# EAGLE schematic Granny Safe (EAGLE 8.4.0)
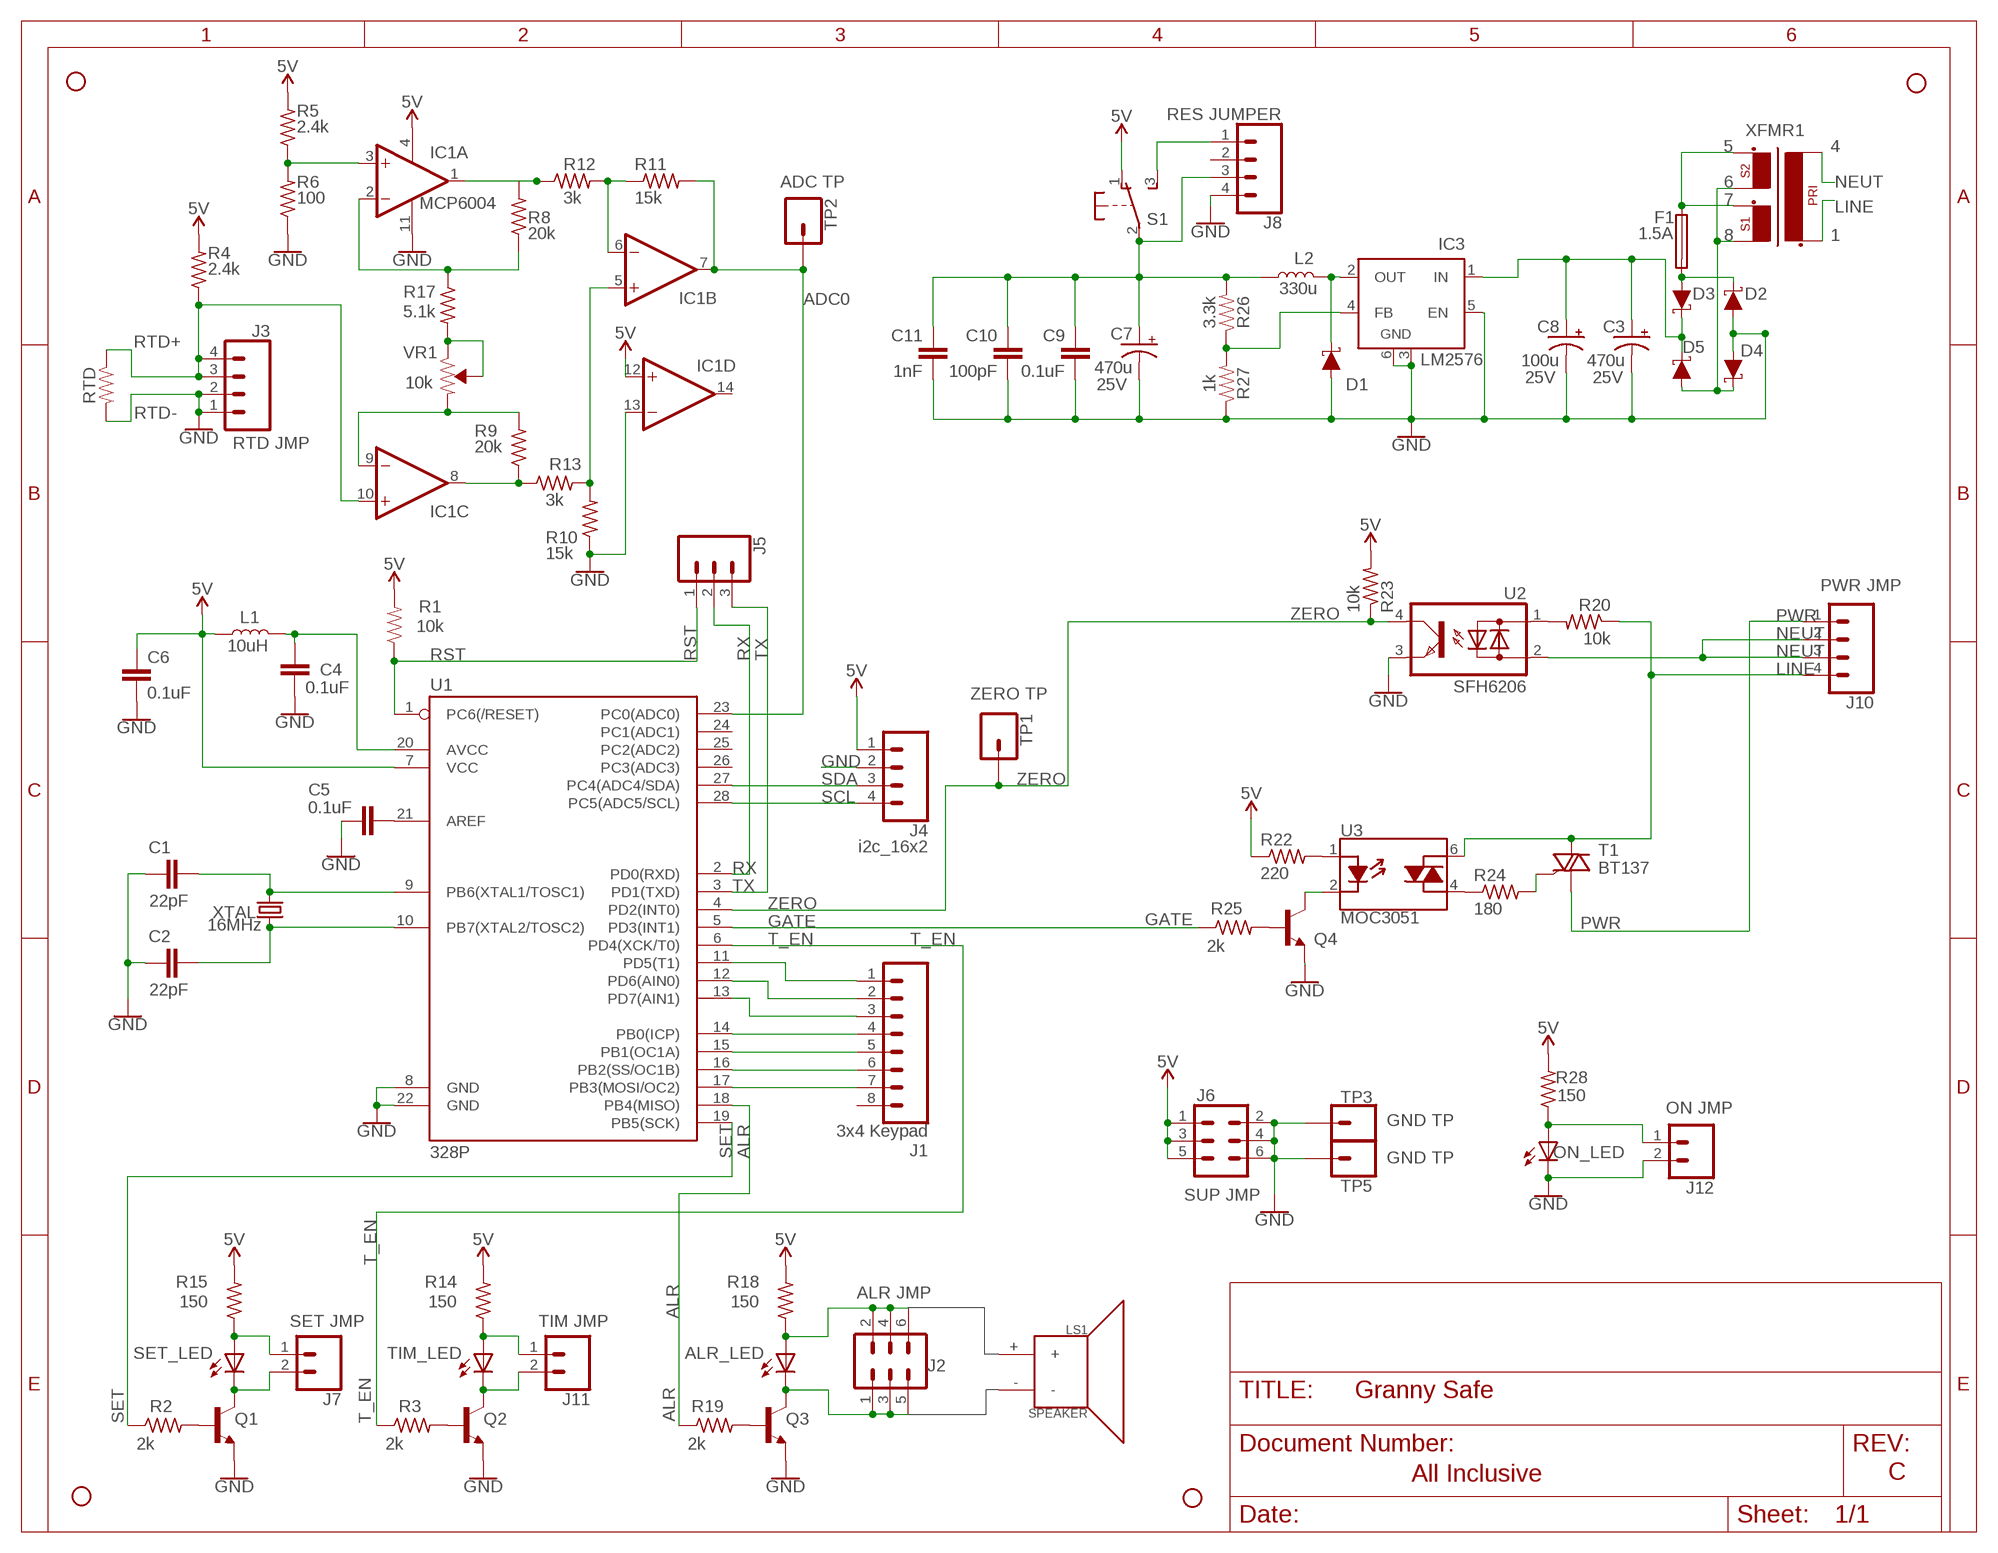
[diagram p0: schematic, sheet 1]

## Parts
ALR_LED  LED5MM  [LED5MM]
C1  22pF  22PF-0603-50V-5%  [0603]
C2  22pF  22PF-0603-50V-5%  [0603]
C3  470u  CPOL-USE3.5-8  [E3,5-8]
C4  0.1uF  0.1UF-0603-25V-(+80/-20%)  [0603]
C5  0.1uF  0.1UF-0603-25V-(+80/-20%)  [0603]
C6  0.1uF  0.1UF-0603-25V-(+80/-20%)  [0603]
C7  470u  CPOL-USE3.5-8  [E3,5-8]
C8  100u  CPOL-USE2-5  [E2-5]
C9  0.1uF  0.1UF-0603-25V-5%  [0603]
C10  100pF  100PF-0603-50V-5%  [0603]
C11  1nF  1.0NF/1000PF-0603-50V-10%  [0603]
D1  DIODE-SCHOTTKY-B340A  [SMA-DIODE]
D2  DIODE-SCHOTTKY-B340A  [SMA-DIODE]
D3  DIODE-SCHOTTKY-B340A  [SMA-DIODE]
D4  DIODE-SCHOTTKY-B340A  [SMA-DIODE]
D5  DIODE-SCHOTTKY-B340A  [SMA-DIODE]
F1  1.5A  TE5  [TE5]
H1  STAND-OFF  [STAND-OFF]
H2  STAND-OFF  [STAND-OFF]
H3  STAND-OFF  [STAND-OFF]
H4  STAND-OFF  [STAND-OFF]
IC1  MCP604SL  [SO14]
IC3  LM2596S  [TO263-5]
J1  3x4 Keypad  CONN_08"  [1X08]
J2  FEMALE 2x3  CONN_03X2FEMALE  [2X3]
J3  SCREW-4  [SCREWTERMINAL-5MM-2]
J4  i2c_16x2  CONN_04  [1X04]
J5  CONN_03  [1X03]
J6  FEMALE 2x3  CONN_03X2FEMALE  [2X3]
J7  CONN_02  [1X02]
J8  RES JUMPER  CONN_04  [1X04]
J10  SCREW-4  [SCREWTERMINAL-5MM-2]
J11  CONN_02  [1X02]
J12  CONN_02  [1X02]
L1  10uH  INDUCTOR-0603-33NH  [0603]
L2  INDUCTOR  [CR75]
LS1  SPEAKER  [PCB_MOUNT_SPEAKER]
ON_LED  LED5MM  [LED5MM]
Q1  TRANS_NPN-MMBTA42  [SOT23-3]
Q2  TRANS_NPN-MMBTA42  [SOT23-3]
Q3  TRANS_NPN-MMBTA42  [SOT23-3]
Q4  2N3904  TRANS_NPN-MMBTA42  [SOT23-3]
R1  10k  10KOHM-0603-1/10W-1%  [0603]
R2  2k  R-US_R0603  [R0603]
R3  2k  R-US_R0603  [R0603]
R4  2.4k  R-US_R0603  [R0603]
R5  2.4k  R-US_R0603  [R0603]
R6  100  R-US_R0603  [R0603]
R8  20k  R-US_R0603  [R0603]
R9  20k  R-US_R0603  [R0603]
R10  15k  R-US_R0603  [R0603]
R11  15k  R-US_R0603  [R0603]
R12  3k  R-US_R0603  [R0603]
R13  3k  R-US_R0603  [R0603]
R14  150  R-US_R0603  [R0603]
R15  150  R-US_R0603  [R0603]
R17  5.1k  R-US_R0603  [R0603]
R18  150  R-US_R0603  [R0603]
R19  2k  R-US_R0603  [R0603]
R20  10k  R-US_R0603  [R0603]
R22  220  R-US_R0603  [R0603]
R23  10k  R-US_R0603  [R0603]
R24  180  R-US_R0603  [R0603]
R25  2k  R-US_R0603  [R0603]
R26  3.3k  3.3KOHM-0603-1/10W-1%  [0603]
R27  1k  1KOHM-0603-1/10W-1%  [0603]
R28  150  R-US_R0603  [R0603]
RTD  10KOHM-HORIZ-1/4W-1%  [AXIAL-0.3]
S1  EG1213  [EG1213]
SET_LED  LED5MM  [LED5MM]
T1  BT137  [TO220BV]
TIM_LED  LED5MM  [LED5MM]
TP1  CONN_01  [1X01]
TP2  CONN_01  [1X01]
TP3  CONN_01  [1X01]
TP5  CONN_01  [1X01]
U1  328P  ATMEGA328P_PDIP  [DIP28]
U2  SFH6206  [DIL4-SMD]
U3  MOC3051  [DIP8SMD]
VR1  10k  TRIMPOT-SMD-3MM-CLOSED-1/8W-20%  [TRIMPOT-SMD-3MM-CLOSED]
XFMR1  EE20-2  [EE20-2]
XTAL  16MHz  CRYSTAL-16MHZPTH-HC49US  [HC49US]

## Nets
5V: C6.1 IC1.4(P:V+) IC1.12(D:+IN) J4.1 J6.1 J6.3 J6.5 L1.1 R1.2 R4.2 R5.2 R14.2 R15.2 R18.2 R22.1 R23.2 R28.2 S1.1(1:O) U1.7(VCC)
ADC0: IC1.7(B:OUT) R11.2 TP2.1 U1.23(PC0(ADC0))
ALR: R19.1 U1.18(PB4(MISO))
GATE: R25.1 U1.5(PD3(INT1))
GND: C1.1 C2.1 C3.- C4.2 C5.2 C6.2 C7.- C8.- C9.2 C10.2 C11.2 D1.A D2.A D4.A IC1.11(P:V-) IC1.13(D:-IN) IC3.3(GND) IC3.5(EN) IC3.6(GND) J3.1 J3.2 J4.2 J6.2 J6.4 J6.6 J8.4 J12.2 ON_LED.K(C) Q1.2(E) Q2.2(E) Q3.2(E) Q4.2(E) R6.1 R10.1 R27.1 RTD.P$2 TP3.1 TP5.1 U1.8(GND) U1.22(GND) U2.3(E)
LINE: J10.4 R20.1 T1.T2(A2) U3.6 XFMR1.1
N$1: C1.2 U1.9(PB6(XTAL1/TOSC1)) XTAL.2
N$2: C2.2 U1.10(PB7(XTAL2/TOSC2)) XTAL.1
N$3: J1.7 U1.17(PB3(MOSI/OC2))
N$4: J8.1 S1.3(1:S)
N$5: C5.1 U1.21(AREF)
N$6: J1.6 U1.16(PB2(SS/OC1B))
N$7: J1.5 U1.15(PB1(OC1A))
N$8: J1.4 U1.14(PB0(ICP))
N$9: J1.3 U1.13(PD7(AIN1))
N$10: J1.2 U1.12(PD6(AIN0))
N$11: J1.1 U1.11(PD5(T1))
N$12: Q1.1(B) R2.2
N$13: IC1.10(C:+IN) J3.3 J3.4 R4.1 RTD.P$1
N$14: Q2.1(B) R3.2
N$15: IC1.3(A:+IN) R5.1 R6.2
N$16: IC1.1(A:OUT) R8.2 R12.1
N$17: J7.1 R15.1 SET_LED.A
N$18: J11.1 R14.1 TIM_LED.A
N$19: J11.2 Q2.3(C) TIM_LED.K(C)
N$20: J7.2 Q1.3(C) SET_LED.K(C)
N$21: R17.2 VR1.2(WIPER) VR1.3(CW)
N$22: D2.C D3.A F1.2
N$23: ALR_LED.K(C) J2.1 J2.3 J2.5 Q3.3(C)
N$24: IC1.2(A:-IN) R8.1 R17.1
N$25: IC1.8(C:OUT) R9.1 R13.1
N$26: IC1.9(C:-IN) R9.2 VR1.1(CCW)
N$27: IC1.5(B:+IN) R10.2 R13.2
N$28: IC1.6(B:-IN) R11.1 R12.2
N$29: R20.2 U2.1(AC1)
N$30: R24.2 T1.G
N$31: R24.1 U3.4
N$32: R22.2 U3.1
N$33: IC3.4(FB) R26.1 R27.2
N$34: Q4.3(C) U3.2
N$35: Q4.1(B) R25.2
N$36: J12.1 ON_LED.A R28.1
N$37: F1.1 XFMR1.5 XFMR1.7
N$38: C7.+ C9.1 C10.1 C11.1 J8.3 L2.P$2 R26.2 S1.2(1:P)
N$39: ALR_LED.A J2.2 J2.4 J2.6 R18.1
N$40: Q3.1(B) R19.2
N$41: D5.A XFMR1.6 XFMR1.8
N$42: D4.C
N$43: C4.1 L1.2 U1.20(AVCC)
N$46: D1.C IC3.2(OUT) L2.P$1
N$51: C3.+ C8.+ D3.C D5.C IC3.1(IN)
NEUT: J10.2 J10.3 U2.2(AC2) XFMR1.4
PWR: J10.1 T1.T1(A1)
RST: J5.1 R1.1 U1.1(PC6(/RESET))
RX: J5.2 U1.2(PD0(RXD))
SCL: J4.4 U1.28(PC5(ADC5/SCL))
SDA: J4.3 U1.27(PC4(ADC4/SDA))
SET: R2.1 U1.19(PB5(SCK))
T_EN: R3.1 U1.6(PD4(XCK/T0))
TX: J5.3 U1.3(PD1(TXD))
ZERO: R23.1 TP1.1 U1.4(PD2(INT0)) U2.4(C)
Unconnected: IC1.14(D:OUT) J1.8 J8.2 LS1.+ LS1.- S1.MT1(MT) S1.MT2(MT) U1.24(PC1(ADC1)) U1.25(PC2(ADC2)) U1.26(PC3(ADC3))

## Notes on the sheet
- ADC TP
- MCP6004
- S1
- 330u
- RTD+
- LM2576
- 25V | 25V
- 25V
- RTD-
- RTD JMP
- PWR JMP
- ZERO TP
- ON JMP
- GND TP
- GND TP
- SUP JMP
- ALR JMP
- SET JMP | TIM JMP
- All Inclusive | C

## Library data of the parts
ALR_LED ON_LED SET_LED TIM_LED = adafruit:LED: LED OSRAM: - CHIPLED LG R971, LG N971, LY N971, LG Q971, LY Q971, LO R971, LY R971 LH N974, LH R974 LS Q976, LO Q976, LY Q976 LO Q996 - Hyper CHIPLED LW Q18S LB Q993, LB Q99A, LB R99A - SideLED LS A670, LO A670, LY A670, LG A670, LP A670 LB A673, LV A673, LT A673, LW A673 LH A674 LY A675 LS A676, LA A676, LO A676, LY A676, LW A676 LS A679, LY A679, LG A679 - Hyper Micro SIDELED® LS Y876, LA Y876, LO Y876, LY Y876 LT Y87S - SmartLED LW L88C, LW L88S LB L89C, LB L89S, LG L890 LS L89K, LO L89K, LY L89K LS L896, LA L896, LO L896, LY L896 - TOPLED LS T670, LO T670, LY T670, LG T670, LP T670 LSG T670, LSP T670, LSY T670, LOP T670, LYG T670 LG T671, LOG T671, LSG T671 LB T673, LV T673, LT T673, LW T673 LH T674 LS T676, LA T676, LO T676, LY T676, LB T676, LH T676, LSB T676, LW T676 LB T67C, LV T67C, LT T67C, LS T67K, LO T67K, LY T67K, LW E67C LS E67B, LA E67B, LO E67B, LY E67B, LB E67C, LV E67C, LT E67C LW T67C LS T679, LY T679, LG T679 LS T770, LO T770, LY T770, LG T770, LP T770 LB T773, LV T773, LT T773, LW T773 LH T774 LS E675, LA E675, LY E675, LS T675 LS T776, LA T776, LO T776, LY T776, LB T776 LHGB T686 LT T68C, LB T68C - Hyper Mini TOPLED® LB M676 - Mini TOPLED Santana® LG M470 LS M47K, LO M47K, LY M47K Source: http://www.osram.convergy.de/
C1 C2 = SparkFun-Capacitors:22PF: 22pF ceramic capacitors A capacitor is a passive two-terminal electrical component used to store electrical energy temporarily in an electric field.; PROD_ID: CAP-07876
C3 C7 C8 = adafruit:CPOL-US: POLARIZED CAPACITOR, American symbol
C4-C6 = SparkFun-Capacitors:0.1UF: 0.1µF ceramic capacitors A capacitor is a passive two-terminal electrical component used to store electrical energy temporarily in an electric field.; PROD_ID: CAP-00810
C9 = SparkFun-Capacitors:0.1UF: 0.1µF ceramic capacitors A capacitor is a passive two-terminal electrical component used to store electrical energy temporarily in an electric field.; PROD_ID: CAP-08604
C10 = SparkFun-Capacitors:100PF: 100pF/0.1nF ceramic capacitors A capacitor is a passive two-terminal electrical component used to store electrical energy temporarily in an electric field.; PROD_ID: CAP-07883
C11 = SparkFun-Capacitors:1.0NF/1000PF: 1nF/1,000pF ceramic capacitors A capacitor is a passive two-terminal electrical component used to store electrical energy temporarily in an electric field.; PROD_ID: CAP-07886
D1-D5 = SparkFun-DiscreteSemi:DIODE-SCHOTTKY: Schottky diode A Schottky diode is a semiconductor diode which has a low forward voltage drop and a very fast switching action.; PROD_ID: DIO-09886; VALUE: 3A/40V/500mV
F1 = fuse:TE5: FUSE Wickmann; OC_FARNELL: unknown; OC_NEWARK: unknown
H1-H4 = SparkFun-Hardware:STAND-OFF: Stand Off Drill holes for mechanically mounting via screws, standoffs, etc. Note: Use the keepout ring to avoid running the screw head into surrounding components. Variant Overviews STAND-OFF - Mechanical footprint for a #4 phillips button head screw. STAND-OFF-TIGHT - Mechanical footprint for a #4 phillips button head screw, Example SparkFun Products Screw - Phillips Head (1/4", 4-40, 10 pack) <https://www.sparkfun.com/products/10453> (PRT-10453) Screw - Phillips Head (1/2", 4-40, 10 pack) <https://www.sparkfun.com/products/10452> (PRT-10452) Screw - Phillips Head (3/4", 4-40, 10 pack) <https://www.sparkfun.com/products/10451> (PRT-10451) Screw - Phillips Head (1", 4-40, 10 pack) <https://www.sparkfun.com/products/10450> (PRT-10450)
IC1 = linear:MCP604: Quad Op Amp 2.7V to 6.0V Single Supply CMOS Source: http://ww1.microchip.com/downloads/en/DeviceDoc/21314g.pdf
IC3 = linear:LM2596S: STEP-DOWN VOLTAGE REGULATOR
J1 = SparkFun-Connectors:CONN_08: Multi connection point. Often used as Generic Header-pin footprint for 0.1 inch spaced/style header connections On any of the 0.1 inch spaced packages, you can populate with these: Break Away Headers - Straight <https://www.sparkfun.com/products/116> (PRT-00116) Break Away Male Headers - Right Angle <https://www.sparkfun.com/products/553> (PRT-00553) Female Headers <https://www.sparkfun.com/products/115> (PRT-00115) Break Away Headers - Machine Pin <https://www.sparkfun.com/products/117> (PRT-00117) Break Away Female Headers - Swiss Machine Pin <https://www.sparkfun.com/products/743> (PRT-00743) Arduino Stackable Header - 8 Pin <https://www.sparkfun.com/products/9279> (PRT-09279) For SCREWTERMINALS and SPRING TERMINALS visit here: Screw Terimnals on SparkFun.com <https://www.sparkfun.com/search/results?term=Screw+Terminals> (5mm/3.5mm/2.54mm spacing) This device is also useful as a general connection point to wire up your design to another part of your project. Our various solder wires solder well into these plated through hole pads. Hook-Up Wire - Assortment (Stranded, 22 AWG) <https://www.sparkfun.com/products/11375> (PRT-11375) Hook-Up Wire - Assortment (Solid Core, 22 AWG) <https://www.sparkfun.com/products/11367> (PRT-11367) View the entire wire category on our website here <https://www.sparkfun.com/categories/141> Special notes: Molex polarized connector foot print use with SKU : PRT-08231 with associated crimp pins and housings. 1MM SMD Version SKU: PRT-10208 NOTES ON THE VARIANTS LOCK and LOCK_LONGPADS... This footprint was designed to help hold the alignment of a through-hole component (i.e. 6-pin header) while soldering it into place. You may notice that each hole has been shifted either up or down by 0.005 of an inch from it's more standard position (which is a perfectly straight line). This slight alteration caused the pins (the squares in the middle) to touch the edges of the holes. Because they are alternating, it causes a "brace" to hold the component in place. 0.005 has proven to be the perfect amount of "off-center" position when using our standard breakaway headers. Although looks a little odd when you look at the bare footprint, once you have a header in there, the alteration is very hard to notice. Also,if you push a header all the way into place, it is covered up entirely on the bottom side.; PROD_ID: CONN-08438
J2 J6 = SparkFun-Connectors:CONN_03X2: Multi connection point. Often used as Generic Header-pin footprint for 0.1 inch spaced/style header connections You can populate with any combo of single row headers, but if you'd like an exact match, check these: Header - 2x3 (Male, 0.1") <https://www.sparkfun.com/products/12807> (PRT-12807) Header - 2x3 (Female, 0.1") <https://www.sparkfun.com/products/13010> (PRT-13010) 2x3 Pin Shrouded Header <https://www.sparkfun.com/products/10877> (PRT-10877) On any of the 0.1 inch spaced packages, you can populate with these: Break Away Headers - Straight <https://www.sparkfun.com/products/116> (PRT-00116) Break Away Male Headers - Right Angle <https://www.sparkfun.com/products/553> (PRT-00553) Female Headers <https://www.sparkfun.com/products/115> (PRT-00115) Break Away Headers - Machine Pin <https://www.sparkfun.com/products/117> (PRT-00117) Break Away Female Headers - Swiss Machine Pin <https://www.sparkfun.com/products/743> (PRT-00743) Special note: the shrouded connector mates well with our 3x2 ribbon cables: Ribbon Crimp Connector - 6-pin (2x3, Female) <https://www.sparkfun.com/products/10651> (PRT-10651) Ribbon Cable - 6 wire (15ft) <https://www.sparkfun.com/products/10646> (PRT-10646); PROD_ID: CONN-11566
J3 J10 = ece:SCREW-4
J4 J8 = SparkFun-Connectors:CONN_04: Multi connection point. Often used as Generic Header-pin footprint for 0.1 inch spaced/style header connections On any of the 0.1 inch spaced packages, you can populate with these: Break Away Headers - Straight <https://www.sparkfun.com/products/116> (PRT-00116) Break Away Male Headers - Right Angle <https://www.sparkfun.com/products/553> (PRT-00553) Female Headers <https://www.sparkfun.com/products/115> (PRT-00115) Break Away Headers - Machine Pin <https://www.sparkfun.com/products/117> (PRT-00117) Break Away Female Headers - Swiss Machine Pin <https://www.sparkfun.com/products/743> (PRT-00743) For SCREWTERMINALS and SPRING TERMINALS visit here: Screw Terimnals on SparkFun.com <https://www.sparkfun.com/search/results?term=Screw+Terminals> (5mm/3.5mm/2.54mm spacing) This device is also useful as a general connection point to wire up your design to another part of your project. Our various solder wires solder well into these plated through hole pads. Hook-Up Wire - Assortment (Stranded, 22 AWG) <https://www.sparkfun.com/products/11375> (PRT-11375) Hook-Up Wire - Assortment (Solid Core, 22 AWG) <https://www.sparkfun.com/products/11367> (PRT-11367) View the entire wire category on our website here <https://www.sparkfun.com/categories/141> Special notes: Molex polarized connector foot print use with SKU : PRT-08231 with associated crimp pins and housings. 1MM SMD Version SKU: PRT-10208; PROD_ID: CONN-09696
J5 = SparkFun-Connectors:CONN_03: Multi connection point. Often used as Generic Header-pin footprint for 0.1 inch spaced/style header connections On any of the 0.1 inch spaced packages, you can populate with these: Break Away Headers - Straight <https://www.sparkfun.com/products/116> (PRT-00116) Break Away Male Headers - Right Angle <https://www.sparkfun.com/products/553> (PRT-00553) Female Headers <https://www.sparkfun.com/products/115> (PRT-00115) Break Away Headers - Machine Pin <https://www.sparkfun.com/products/117> (PRT-00117) Break Away Female Headers - Swiss Machine Pin <https://www.sparkfun.com/products/743> (PRT-00743) Stackable Header - 3 Pin (Female, 0.1") <https://www.sparkfun.com/products/13875> (PRT-13875) For SCREWTERMINALS and SPRING TERMINALS visit here: Screw Terimnals on SparkFun.com <https://www.sparkfun.com/search/results?term=Screw+Terminals> (5mm/3.5mm/2.54mm spacing) This device is also useful as a general connection point to wire up your design to another part of your project. Our various solder wires solder well into these plated through hole pads. Hook-Up Wire - Assortment (Stranded, 22 AWG) <https://www.sparkfun.com/products/11375> (PRT-11375) Hook-Up Wire - Assortment (Solid Core, 22 AWG) <https://www.sparkfun.com/products/11367> (PRT-11367) View the entire wire category on our website here <https://www.sparkfun.com/categories/141> Special notes: Molex polarized connector foot print use with SKU : PRT-08232 with associated crimp pins and housings.
J7 J11 J12 = SparkFun-Connectors:CONN_02: Multi connection point. Often used as Generic Header-pin footprint for 0.1 inch spaced/style header connections On any of the 0.1 inch spaced packages, you can populate with these: Break Away Headers - Straight <https://www.sparkfun.com/products/116> (PRT-00116) Break Away Male Headers - Right Angle <https://www.sparkfun.com/products/553> (PRT-00553) Female Headers <https://www.sparkfun.com/products/115> (PRT-00115) Break Away Headers - Machine Pin <https://www.sparkfun.com/products/117> (PRT-00117) Break Away Female Headers - Swiss Machine Pin <https://www.sparkfun.com/products/743> (PRT-00743) For SCREWTERMINALS and SPRING TERMINALS visit here: Screw Terimnals on SparkFun.com <https://www.sparkfun.com/search/results?term=Screw+Terminals> (5mm/3.5mm/2.54mm spacing) This device is also useful as a general connection point to wire up your design to another part of your project. Our various solder wires solder well into these plated through hole pads. Hook-Up Wire - Assortment (Stranded, 22 AWG) <https://www.sparkfun.com/products/11375> (PRT-11375) Hook-Up Wire - Assortment (Solid Core, 22 AWG) <https://www.sparkfun.com/products/11367> (PRT-11367) View the entire wire category on our website here <https://www.sparkfun.com/categories/141> Special notes: Molex polarized connector foot print use with: PRT-08233 with associated crimp pins and housings. 2.54_SCREWTERM for use with PRT-10571. 3.5mm Screw Terminal footprints for PRT-08084 5mm Screw Terminal footprints for use with PRT-08432
L1 = SparkFun-Coils:INDUCTOR: Inductors Resist changes in electrical current. Basically a coil of wire. SparkFun Products: SparkFun Load Cell Amplifier - HX711 <https://www.sparkfun.com/products/13879> IOIO-OTG - V2.2 <https://www.sparkfun.com/products/13613>; PROD_ID: NDUC-07874; VALUE: 33nH/±5%/500mA
L2 = ece:INDUCTOR
LS1 = SparkFun-Electromechanical:SPEAKER: Speaker Generic 2-terminal loudspeakers SparkFun Products Speaker - PCB Mount <https://www.sparkfun.com/products/11089> (COM-11089); PROD_ID: COMP-11789; SF_SKU: COM-11089
Q1-Q4 = SparkFun-DiscreteSemi:TRANS_NPN: NPN transistor Current controlled devices typically used to amplify current or used as a switch. BC547 - COM-08928 <http://www.sparkfun.com/products/8928> (TO-92 45V 100mA) (1.Collector 2.Base 3.Emitter) 2N3904 - COM-00521 <http://www.sparkfun.com/products/521> (TO-92 40V 200mA) (1.Emitter 2.Base 3.Collector) P2N2222A - COM-12852 <http://www.sparkfun.com/products/12852> (TO-92 40V 600mA) (1.Collector 2.Base 3.Emitter); PROD_ID: TRANS-09116; VALUE: 500mA/300V
R1 = SparkFun-Resistors:10KOHM: 10kΩ resistor A resistor is a passive two-terminal electrical component that implements electrical resistance as a circuit element. Resistors act to reduce current flow, and, at the same time, act to lower voltage levels within circuits. - Wikipedia; PROD_ID: RES-00824
R2 R3 R14 R15 R18-R20 R22-R25 R28 = adafruit:R-US_: RESISTOR, American symbol
R4-R6 R8-R13 R17 = resistor:R-US_: RESISTOR, American symbol
R26 = SparkFun-Resistors:3.3KOHM: 3.3kΩ resistor A resistor is a passive two-terminal electrical component that implements electrical resistance as a circuit element. Resistors act to reduce current flow, and, at the same time, act to lower voltage levels within circuits. - Wikipedia; PROD_ID: RES-07851
R27 = SparkFun-Resistors:1KOHM: 1kΩ resistor A resistor is a passive two-terminal electrical component that implements electrical resistance as a circuit element. Resistors act to reduce current flow, and, at the same time, act to lower voltage levels within circuits. - Wikipedia; PROD_ID: RES-07856
RTD = SparkFun-Resistors:10KOHM: 10kΩ resistor A resistor is a passive two-terminal electrical component that implements electrical resistance as a circuit element. Resistors act to reduce current flow, and, at the same time, act to lower voltage levels within circuits. - Wikipedia; PROD_ID: RES-12183; VALUE: 10k
S1 = adafruit:EG1213: E-Switch right-angle slide SPDT Part #EG1213 http://www.ladyada.net/library/eagle
T1 = ece:BT137
TP1-TP3 TP5 = SparkFun-Connectors:CONN_01: Single connection point. Often used as Generic Header-pin footprint for 0.1 inch spaced/style header connections On any of the 0.1 inch spaced packages, you can populate with these: Break Away Headers - Straight <https://www.sparkfun.com/products/116> (PRT-00116) Break Away Male Headers - Right Angle <https://www.sparkfun.com/products/553> (PRT-00553) Female Headers <https://www.sparkfun.com/products/115> (PRT-00115) Break Away Headers - Machine Pin <https://www.sparkfun.com/products/117> (PRT-00117) Break Away Female Headers - Swiss Machine Pin <https://www.sparkfun.com/products/743> (PRT-00743) This device is also useful as a general connection point to wire up your design to another part of your project. Our various solder wires solder well into these plated through hole pads. Hook-Up Wire - Assortment (Stranded, 22 AWG) <https://www.sparkfun.com/products/11375> (PRT-11375) Hook-Up Wire - Assortment (Solid Core, 22 AWG) <https://www.sparkfun.com/products/11367> (PRT-11367) View the entire wire category on our website here <https://www.sparkfun.com/categories/141> Special notes: SMTSO-256-ET is a "flush mount" nut for a 4-40 screw. We mostly use this on specialty testbeds; it is a nice way to connect hardware to your PCB at an adjustable hieght. Also note, the SNAP packages are for using a snappable style connector. We sell a baggie of snaps and they are also used on two LilyPad designs: Snap Assortment - 30 pack (male and female) <https://www.sparkfun.com/products/11347> (DEV-11347) LilyPad Arduino SimpleSnap <https://www.sparkfun.com/products/10941> (DEV-10941) LilyPad SimpleSnap Protoboard <https://www.sparkfun.com/products/10940> (DEV-10940)
U1 = SparkFun-IC-Microcontroller:ATMEGA328P_PDIP: Atmel 328P Through hole ATMEGA328P uC used in the Arduino 32kb flash, 1k EEPROM, 2k SRAM Datasheet <http://www.sparkfun.com/datasheets/Components/SMD/ATMega328.pdf> SparkFun Products Storefront component: AVR 28 Pin 20MHz 32K 6A/D - ATMega328P <https://www.sparkfun.com/products/9061> (COM-09061) SparkFun Simon Says - Through-Hole Soldering Kit <https://www.sparkfun.com/products/10547> (KIT-10547) SparkFun Learn to Solder - Simon Says <https://www.sparkfun.com/products/13708> (KIT-13708) SparkFun BigTime Watch Kit <https://www.sparkfun.com/products/11734> (KIT-11734) SparkFun ClockIt <https://www.sparkfun.com/products/10930> (KIT-10930) SparkFun Serial Enabled LCD Kit <https://www.sparkfun.com/products/10097> (LCD-10097) SparkFun Simon Tilts - Through Hole Soldering Kit <https://www.sparkfun.com/products/12634> (KIT-12634) SparkFun Frequency Counter Kit <https://www.sparkfun.com/products/10140> (KIT-10140) FabFM Radio Kit <https://www.sparkfun.com/products/11043> (KIT-11043) SparkFun Binary Blaster Kit <https://www.sparkfun.com/products/12037> (KIT-12037) SparkFun Metro-Gnome <https://www.sparkfun.com/products/9236> (KIT-09236) ATmega328 with Arduino Optiboot (Uno) <https://www.sparkfun.com/products/10524> (DEV-10524); PROD_ID: IC-09136
U2 = optocoupler:SFH620: Optocoupler, Phototransistor Output, AC Input Source: http://www.vishay.com/docs/83675/sfh620.pdf; MF: VISHAY/TELEFUNKEN; MPN: SFH6206-3; OC_FARNELL: 1469585; OC_NEWARK: 58K2214
U3 = ece:MOC3051
VR1 = SparkFun-Resistors:TRIMPOT: Trimming Potentiometer (Trimpot) Three-terminal potentiometers, with an adjustable wiper and two adjustable resistors. A pot can be used to create a configurable voltage divider, or as a variable resistor. "Trimpots" are a subset of potentiometers, usually intended for "set-and-forget" applications. They're often more delicate than standard potentiometers - rated for fewer turns. Variants PTH-KNOB - PTH Trimpot w/ finger-adjustable knob Trimpot 10K with Knob <https://www.sparkfun.com/products/9806> (COM-09806) Datasheet <http://www.sparkfun.com/datasheets/Components/General/TSR-3386.pdf> SMD-3MM-CLOSED-FRAME - SMD 3mm Square Closed-Frame Trimpot Used on e.g. EasyDriver - Stepper Motor Driver <https://www.sparkfun.com/products/12779> Datasheet <http://www.bitechnologies.com/pdfs/22.pdf> (22AR10KTR) SMD-5MM - SMD 5mm Square Closed-Frame Trimpot Used on e.g. IOIO-OTG - V2.2 <https://www.sparkfun.com/products/13613> Datasheet <http://www.vishay.com/docs/51008/ts53.pdf> (TS53YL502MR10) SMD-3MM-1/10W-25% - 3mm Square Open-Frame Trimpot Used on e.g. SparkFun Shapeoko <https://www.sparkfun.com/products/13899> Datasheet <http://www.bourns.com/docs/Product-Datasheets/TC33.pdf> (TC33X-2-103E); PROD_ID: RES-09285
XFMR1 = ece:EE20-2: TRANSFORMER 1 primary winding, 2 secondary windings ERA
XTAL = SparkFun-Clocks:CRYSTAL-16MHZ: 16MHz Crystal Digikey Example <http://www.digikey.com/product-search/en?keywords=535-9122-1-ND> Frequency: 16MHz Frequency Stability: ±50ppm Frequency Tolerance: ±20ppm Load Capacitance: 18pF SparkFun Products: Pro Micro -5V/16MHz <https://www.sparkfun.com/products/12640> SparkFun Serial Enabled LCD Kit <https://www.sparkfun.com/products/10097>; PROD_ID: XTAL-08181; SF_ID: COM-00536